# EAGLE design YCCC Stack (EAGLE 6.2)
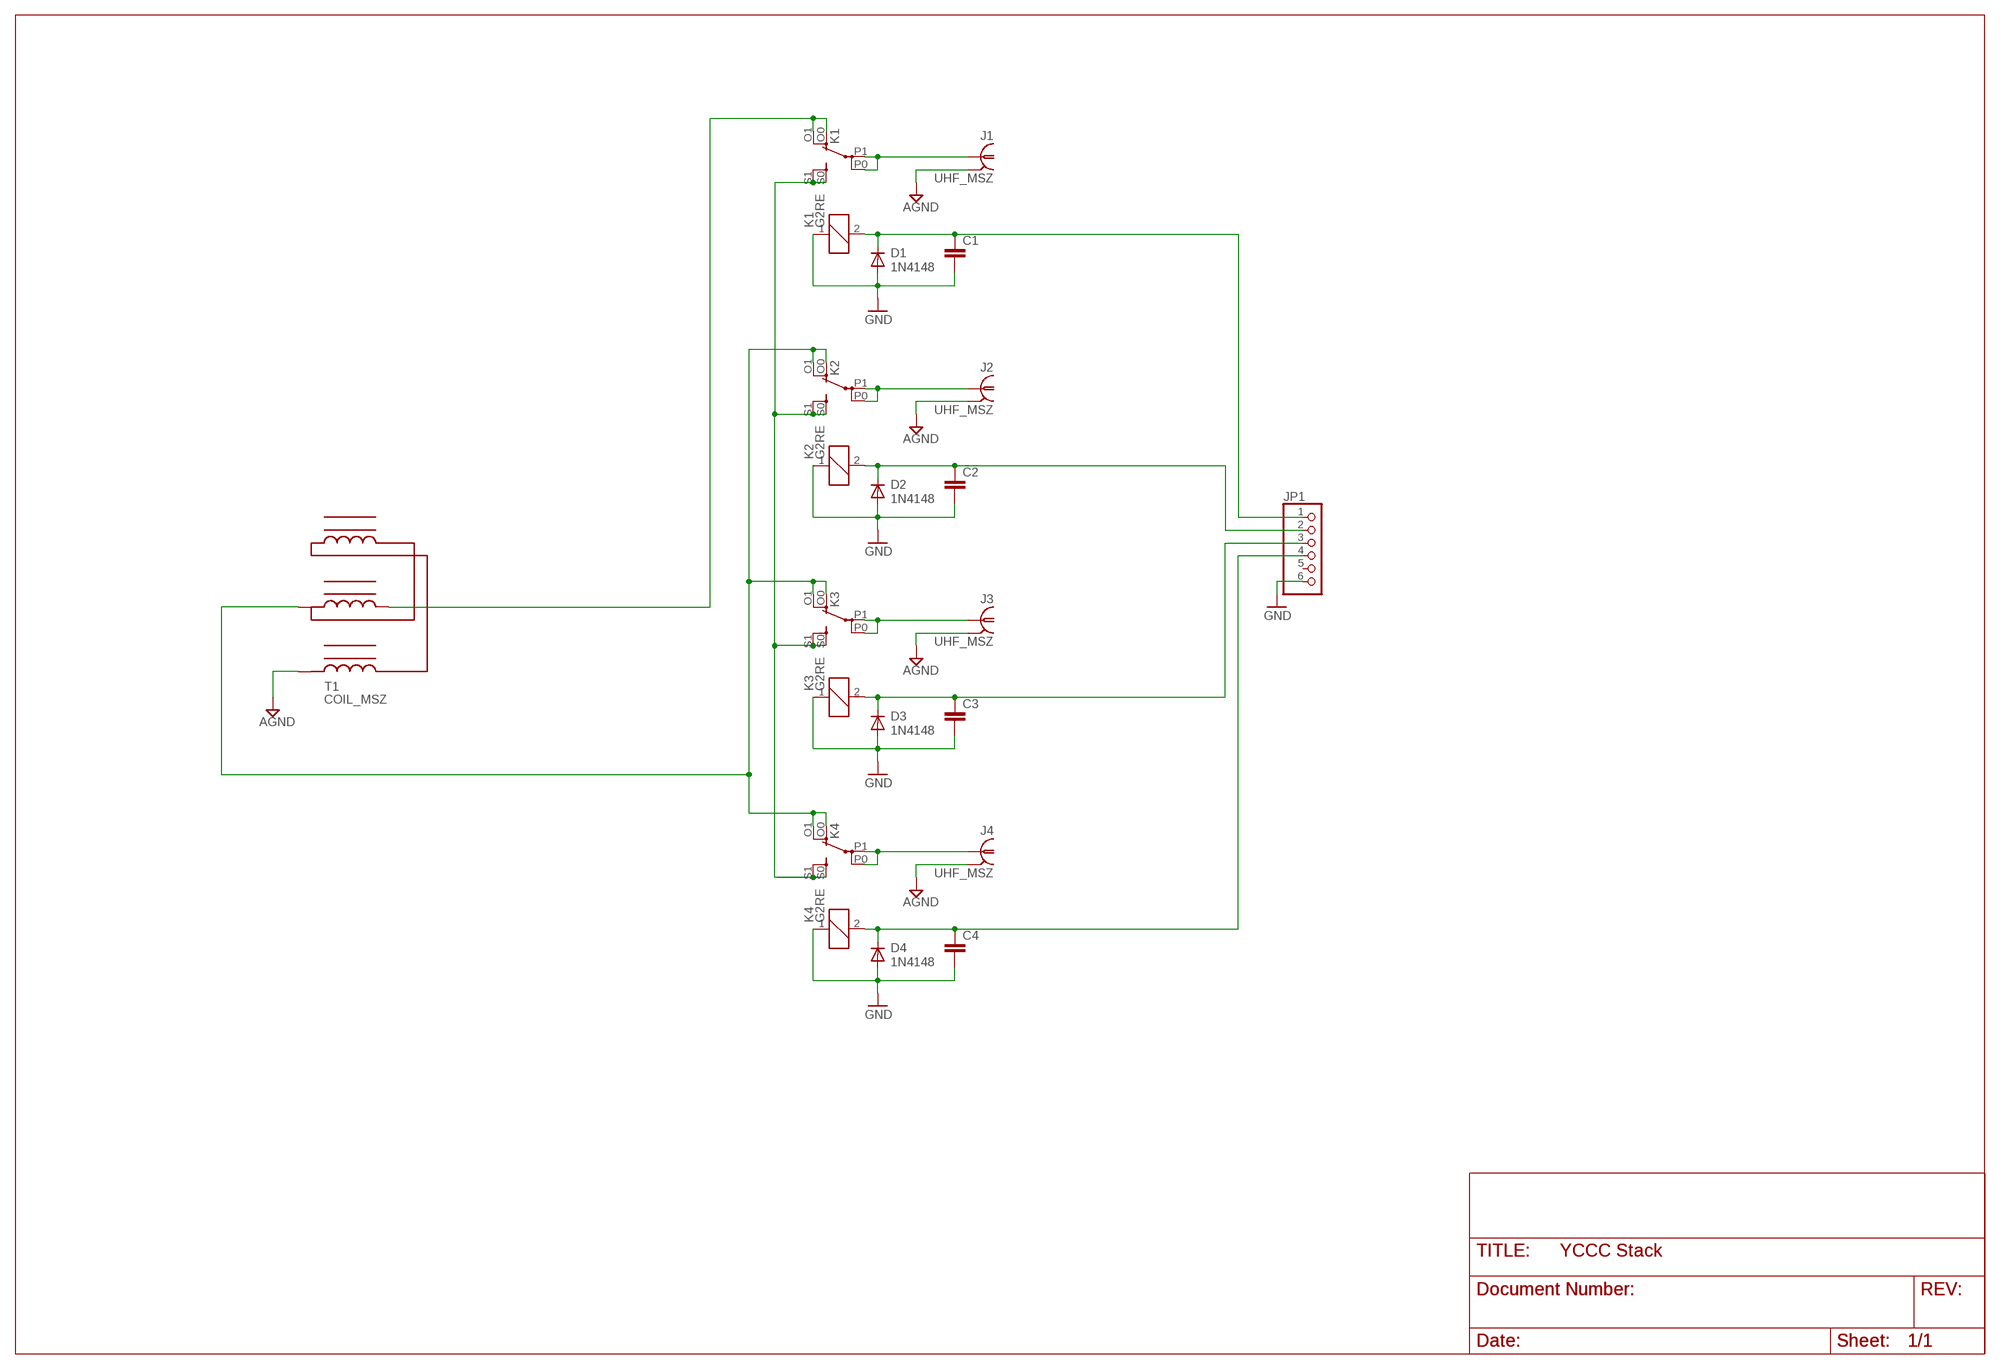
[diagram p0: schematic, sheet 1]

## Parts
C1  C-EU050-035X075  [C050-035X075]
C2  C-EU050-035X075  [C050-035X075]
C3  C-EU050-035X075  [C050-035X075]
C4  C-EU050-035X075  [C050-035X075]
D1  1N4148  1N4148DO35-7  [DO35-7]
D2  1N4148  1N4148DO35-7  [DO35-7]
D3  1N4148  1N4148DO35-7  [DO35-7]
D4  1N4148  1N4148DO35-7  [DO35-7]
J1  UHF_MSZ  [BNC_MSZ]
J2  UHF_MSZ  [BNC_MSZ]
J3  UHF_MSZ  [BNC_MSZ]
J4  UHF_MSZ  [BNC_MSZ]
JP1  PINHD-1X6  [1X06]
K1  G2RE  [G2RE]
K2  G2RE  [G2RE]
K3  G2RE  [G2RE]
K4  G2RE  [G2RE]
T1  COIL_MSZ  [COIL_MSZ]

## Nets
AGND [POWER]: J1.P$1(GND) J2.P$1(GND) J3.P$1(GND) J4.P$1(GND) T1.3(GND)
GND: C1.2 C2.2 C3.2 C4.2 D1.A D2.A D3.A D4.A JP1.6 K1.1 K2.1 K3.1 K4.1
N$1: C1.1 D1.C JP1.1 K1.2
N$2 [POWER]: J1.P$2 K1.P0(2:P) K1.P1(2:P)
N$3: C2.1 D2.C JP1.2 K2.2
N$4 [POWER]: J2.P$2 K2.P0(2:P) K2.P1(2:P)
N$5: C3.1 D3.C JP1.3 K3.2
N$6 [POWER]: J3.P$2 K3.P0(2:P) K3.P1(2:P)
N$7: C4.1 D4.C JP1.4 K4.2
N$8 [POWER]: J4.P$2 K4.P0(2:P) K4.P1(2:P)
N$11 [POWER]: K1.S0(2:S) K1.S1(2:S) K2.S0(2:S) K2.S1(2:S) K3.S0(2:S) K3.S1(2:S) K4.S0(2:S) K4.S1(2:S)
N$12 [POWER]: K1.O0(2:O) K1.O1(2:O) T1.1
N$13 [POWER]: K2.O0(2:O) K2.O1(2:O) K3.O0(2:O) K3.O1(2:O) K4.O0(2:O) K4.O1(2:O) T1.2
Unconnected: JP1.5

## Library data of the parts
C1-C4 = rcl:C-EU: CAPACITOR, European symbol
D1-D4 = diode:1N4148: DIODE high speed (Philips)
J1-J4 = various:UHF_MSZ
JP1 = pinhead:PINHD-1X6: PIN HEADER
K1-K4 = relay:G2RE: RELAY 1 x switch, high current, Omron; OC_FARNELL: unknown; OC_NEWARK: unknown
T1 = various:COIL_MSZ

## Net classes
0 default: width 0.8 mm, clearance 0.4 mm
1 POWER: width 3 mm, clearance 1 mm

## Board
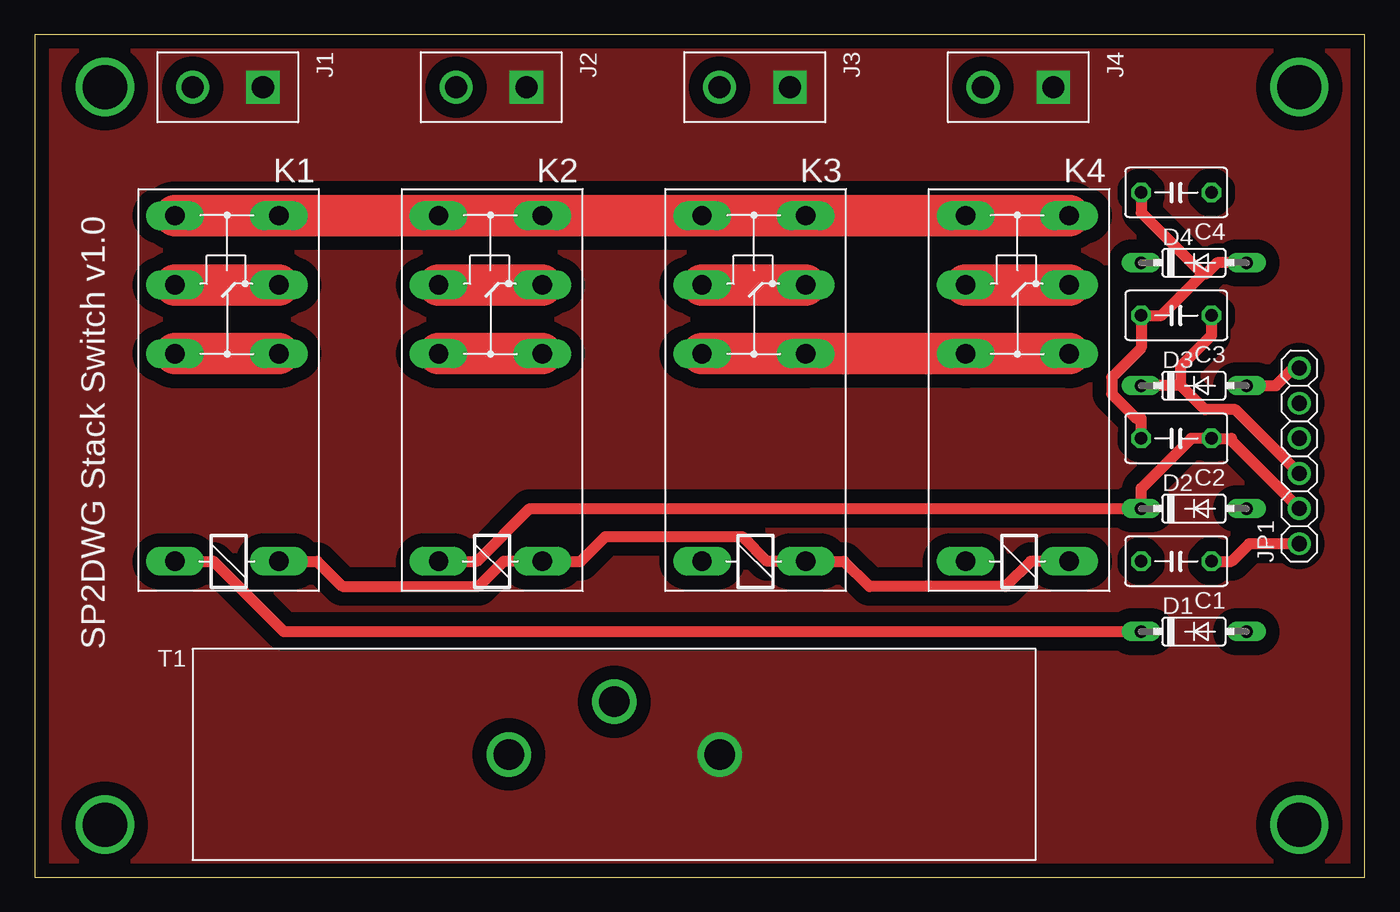
[diagram p1: board, top side]
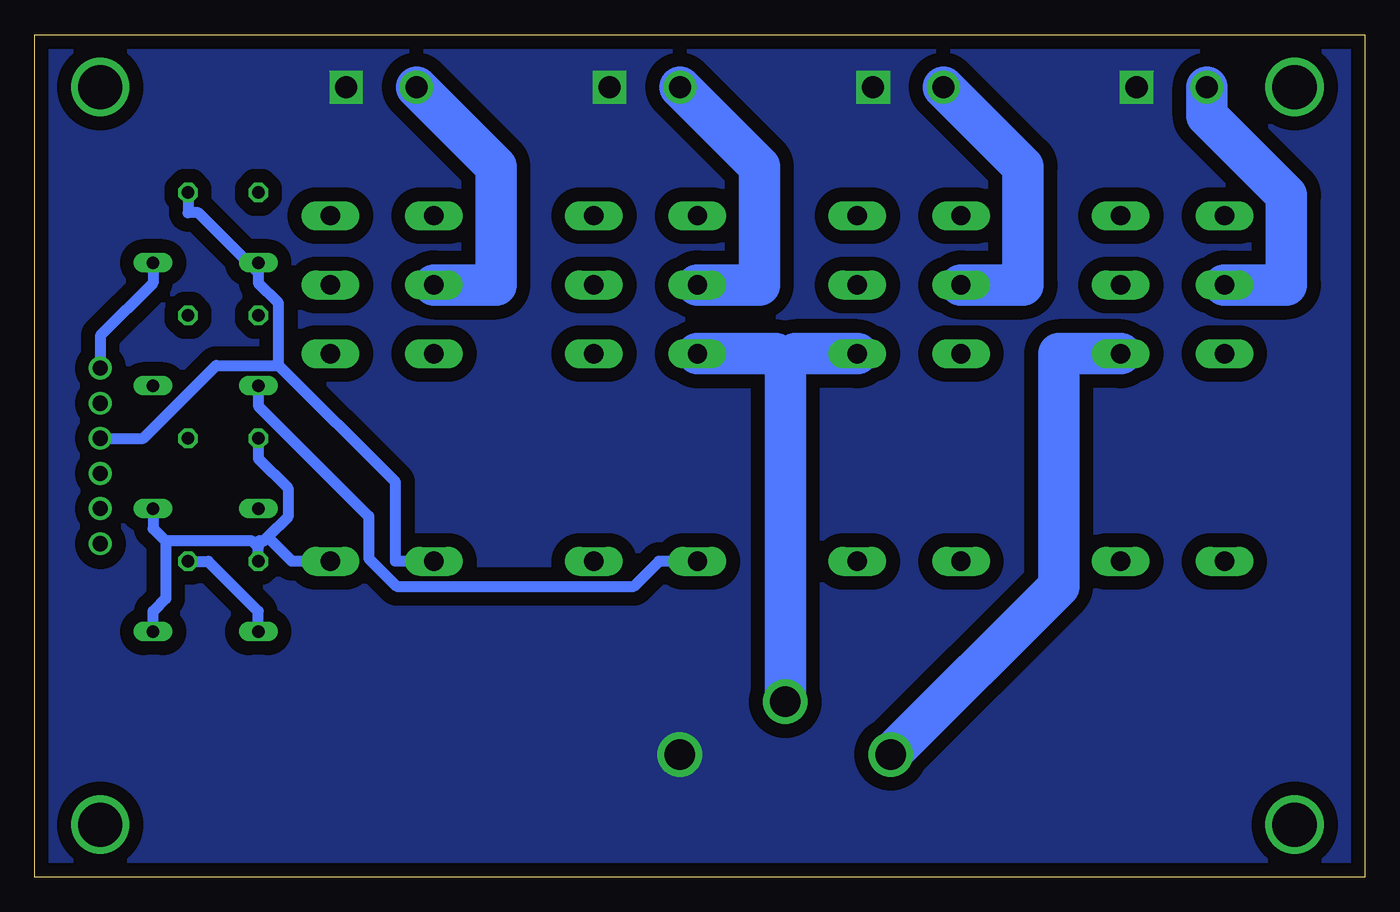
[diagram p2: board, bottom side, seen from below]

Size 96.19 x 60.95 mm. Coordinates in mm from the lower left corner, seen from the top.
Outline: 0,0 96.19,0 96.19,60.95 0,60.95 0,0
Copper layers (1*16): Top 0.035mm / dielectric 1.5mm / Bottom 0.035mm
Design rules: minimum track width 10mil, minimum drill 24mil, track to track 8mil, track to pad 8mil, pad to pad 8mil, via to via 8mil, smd to smd 8mil, copper to edge 40mil, drill to drill 8mil, minimum pad ring 10mil, minimum via ring 8mil, stop-mask expansion 4mil, vias tented up to drill 0mil, thermal gap 10mil

### Footprints (pad centres in the part's own frame; a part is rotated, then mirrored left to right if it is on the bottom)
C050-035X075 = drill 0.9 octagon: 1 -2.54,0; 2 2.54,0
DO35-7 = drill 0.9 long: A 3.81,0; C -3.81,0
BNC_MSZ = drill 1.6 square: P$1 0,0 | drill 1.6: P$2 5.08,0
1X06 = drill 1.1: 1 -6.35,0; 2 -3.81,0; 3 -1.27,0; 4 1.27,0; 5 3.81,0; 6 6.35,0
G2RE = drill 1.4 long: 1 -2.54,-3.683; 2 -2.54,3.81; O0 12.471,-3.683; O1 12.471,3.81; P0 17.45,-3.683; P1 17.45,3.81; S0 22.454,-3.683; S1 22.454,3.81
COIL_MSZ = drill 2.2: 1 0,0; 2 7.62,3.81; 3 15.24,0

### Placement (x,y rotation side)
C1  82.55,22.86 180 top
C2  82.55,31.75 180 top
C3  82.55,40.64 180 top
C4  82.55,49.53 180 top
D1  83.82,17.78 0 top
D2  83.82,26.67 0 top
D3  83.82,35.56 0 top
D4  83.82,44.45 0 top
J1  16.51,57.15 180 top
J2  35.56,57.15 180 top
J3  54.61,57.15 180 top
J4  73.66,57.15 180 top
JP1  91.44,30.48 90 top
K1  13.97,25.4 90 top
K2  33.02,25.4 90 top
K3  52.07,25.4 90 top
K4  71.12,25.4 90 top
T1  34.29,8.89 0 top

### Tracks (layer width: path | path; a pad name or v marks a point on that pad's centre or on a via)
AGND
  pour Bottom (no thermals): 0,60.96 0,0 96.52,0 96.52,60.96
  pour Top (no thermals): 0,60.96 0,0 96.52,0 96.52,60.96
GND
  Top 0.8: D4.A 85.51,44.45 84.71,43.65 84.43,43.65 | 84.43,43.65 80.01,48.07 C4.2 | 84.43,43.65 84.43,43.6 81.47,40.64 C3.2 80.01,38.29 77.88,36.15 77.88,34.97 79.63,33.21 80.01,33.21 C2.2 | K4.1 72.02,22.86 70.19,21.03 60.37,21.03 58.53,22.86 K3.1 52.97,22.86 51.18,24.65 41.28,24.65 39.48,22.86 K2.1 33.92,22.86 32.11,21.05 22.24,21.05 20.43,22.86 K1.1 | D3.A 89.75,35.56 91.02,36.83 JP1.6
  Bottom 0.8: D4.A 87.63,42.99 91.44,39.18 JP1.6 | 79.34,24.61 79.63,24.32 80.01,24.32 80.01,23.89 | 79.34,24.61 77.87,26.08 77.87,28.15 80.01,30.29 C2.2 | 79.34,24.61 77.58,22.86 K4.1 | D2.A 87.63,25.21 87.58,25.21 86.7,24.32 | 86.7,24.32 86.7,20.17 87.63,19.24 D1.A | 80.01,23.89 80.44,24.32 86.7,24.32 | C1.2 80.01,23.89
N$1
  Top 0.8: C1.1 86.55,22.86 87.82,24.13 JP1.1 | K1.2 12.94,22.86 18.02,17.78 D1.C
  Bottom 0.8: C1.1 83.63,22.86 80.01,19.24 D1.C
N$2
  Top 3: K1.P1 K1.P0
  Bottom 3: K1.P1 5.68,42.85 5.68,49.32 11.43,55.07 J1.P$2
N$3
  Top 0.8: JP1.2 86.55,31.56 86.55,31.75 C2.1 83.63,31.75 80.01,28.13 D2.C 35.8,26.67 31.99,22.86 K2.2
N$4
  Top 3: K2.P1 K2.P0
  Bottom 3: K2.P1 24.73,42.85 24.73,51.4 J2.P$2
N$5
  Top 0.8: 82.88,35.56 82.88,36.97 85.09,39.18 C3.1 | JP1.3 86.83,33.82 84.62,33.82 82.88,35.56 | 82.88,35.56 D3.C
  Bottom 0.8: K3.2 51.04,22.86 52.85,21.05 70,21.05 72.02,23.08 72.02,26.11 80.01,34.1 D3.C
N$6
  Top 3: K3.P1 K3.P0
  Bottom 3: K3.P1 43.78,42.85 43.78,51.4 J3.P$2
N$7
  Bottom 0.8: C4.1 85.09,48.07 84.36,48.07 80.01,43.72 | 80.01,43.72 80.01,42.99 78.54,41.52 78.54,37.03 | D4.C 80.01,43.72 | 78.54,37.03 70.09,28.58 70.09,22.86 K4.2 | JP1.4 88.33,31.75 83.05,37.03 78.54,37.03
N$8
  Top 3: K4.P1 K4.P0
  Bottom 3: K4.P1 62.83,42.85 62.83,51.4 J4.P$2
N$9  (via drill 3.2)
  other vias: 5.08,57.15
N$10  (via drill 3.2)
  other vias: 5.08,3.81
N$11
  Top 3: K1.S1 K1.S0 K2.S1 K2.S0 K3.S1 K3.S0 K4.S1 K4.S0
N$12
  Top 3: K1.O1 K1.O0
  Bottom 3: K1.O0 22.13,37.87 22.13,21.05 T1.1
N$13
  Top 3: K2.O1 K2.O0 | K3.O1 K3.O0 K4.O1 K4.O0
  Bottom 3: 41.91,37.15 41.18,37.87 K2.O0 | T1.2 41.91,37.15 | K3.O1 42.64,37.87 41.91,37.15
N$14  (via drill 3.2)
  other vias: 91.44,3.81
N$15  (via drill 3.2)
  other vias: 91.44,57.15

### Text on the board
tPlace: SP2DWG Stack Switch v1.0